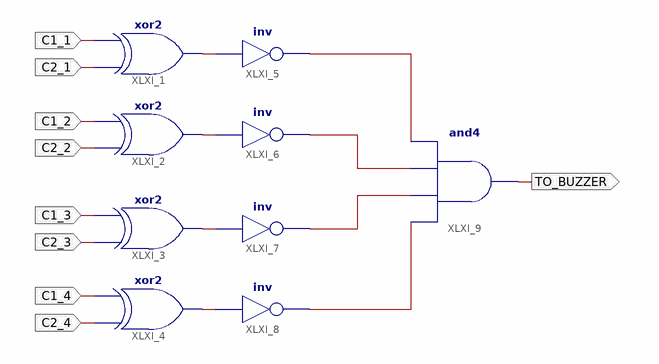
[diagram p0: schematic sheet 1]
// Xilinx ISE schematic Compare_fix.sch (spartan6) as structural Verilog: 9 symbols, 9 ports
module Compare_fix (
  input  C1_1,
  input  C2_1,
  input  C1_2,
  input  C2_2,
  input  C1_3,
  input  C2_3,
  input  C1_4,
  input  C2_4,
  output TO_BUZZER
);

  wire XLXN_1, XLXN_2, XLXN_3, XLXN_4, XLXN_6, XLXN_7, XLXN_8, XLXN_9;

  xor XLXI_1 (XLXN_1, C2_1, C1_1);
  xor XLXI_2 (XLXN_2, C2_2, C1_2);
  xor XLXI_3 (XLXN_3, C2_3, C1_3);
  xor XLXI_4 (XLXN_4, C2_4, C1_4);
  not XLXI_5 (XLXN_6, XLXN_1);
  not XLXI_6 (XLXN_7, XLXN_2);
  not XLXI_7 (XLXN_8, XLXN_3);
  not XLXI_8 (XLXN_9, XLXN_4);
  and XLXI_9 (TO_BUZZER, XLXN_9, XLXN_8, XLXN_7, XLXN_6);
endmodule
